# EAGLE design USB Connector (EAGLE 6.5.0)
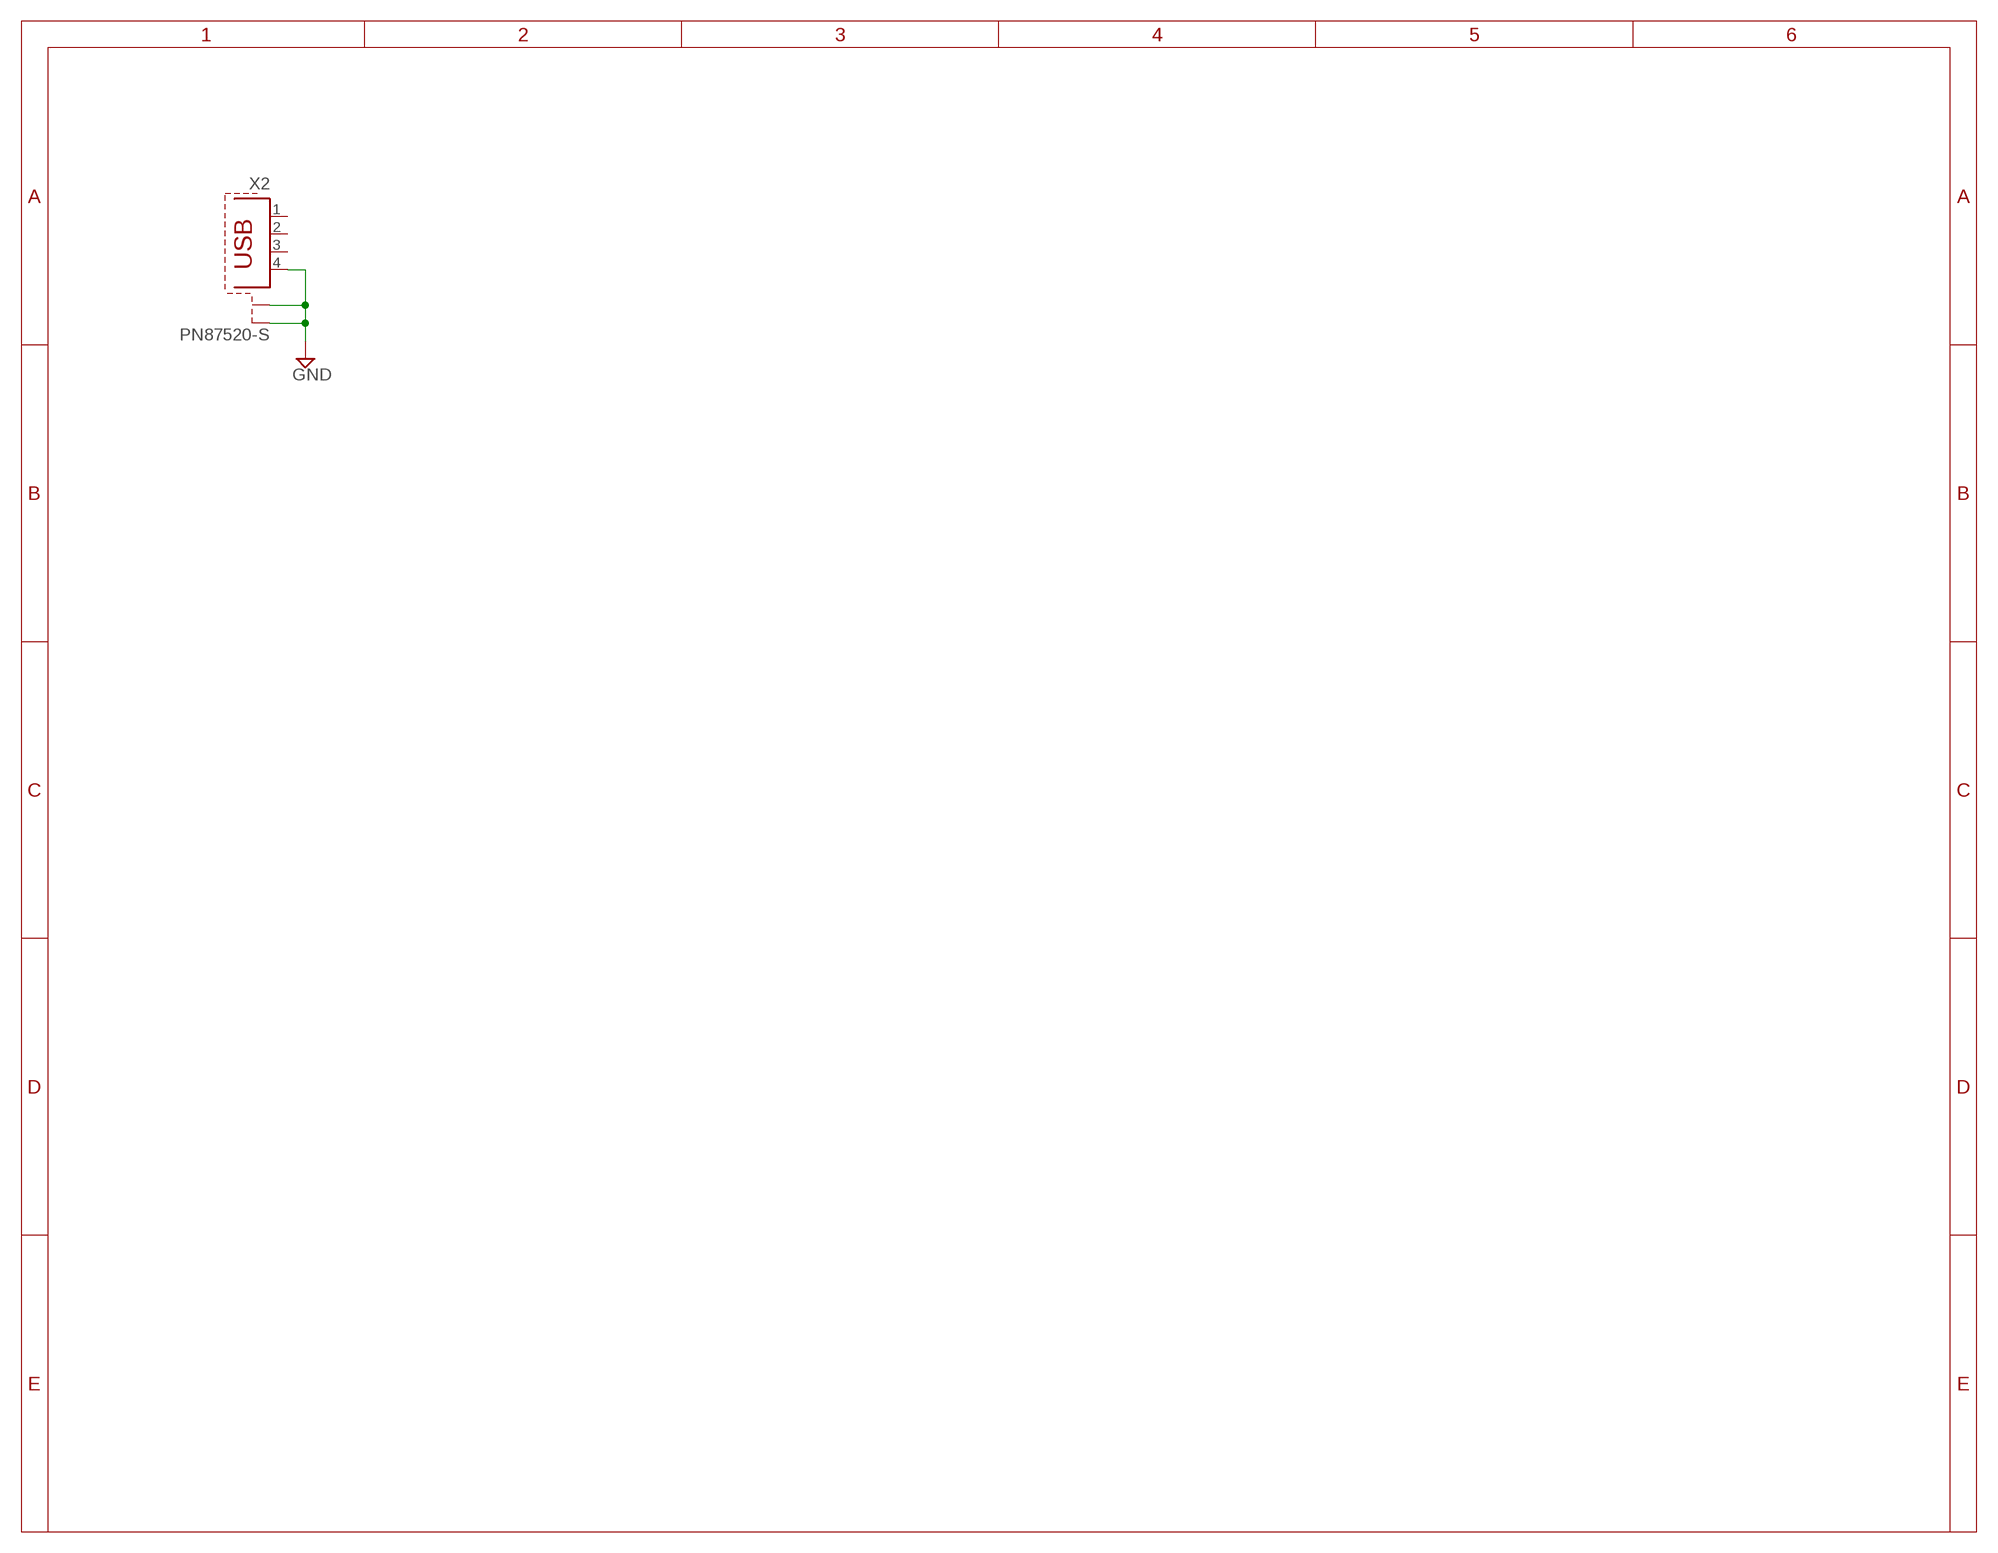
[diagram p0: schematic, sheet 1]

## Parts
X2  PN87520-S  [PN87520-S]

## Nets
GND: X2.4 X2.S1 X2.S2
Unconnected: X2.1 X2.2 X2.3

## Library data of the parts
X2 = con-berg:PN87520-S; OC_FARNELL: unknown; OC_NEWARK: unknown

## Net classes
1 diff: width 0.003 mm, drill 0.006 mm, clearance 0.007 mm

## Board
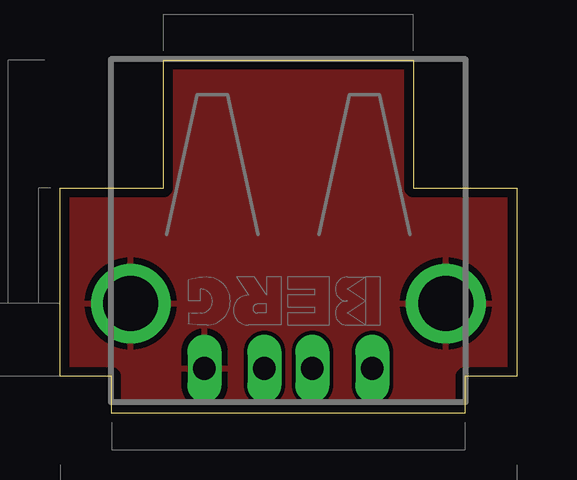
[diagram p1: board, top side]
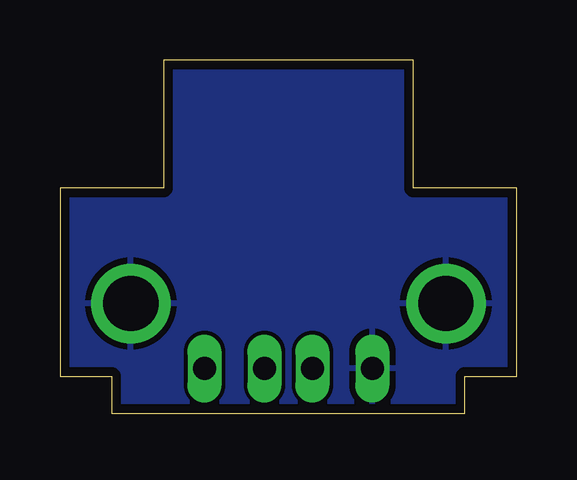
[diagram p2: board, bottom side, seen from below]

Size 19.05 x 14.73 mm. Coordinates in mm from the lower left corner, seen from the top.
Outline: 2.16,0 2.16,1.52 0,1.52 0,9.4 4.32,9.4 4.32,14.73 14.73,14.73 14.73,9.4 19.05,9.4 19.05,1.52 16.89,1.52 16.89,0 2.16,0
Copper layers (1*16): Top 0.0356mm / dielectric 1.5011mm / Bottom 0.0356mm
Design rules "oshpark-2layer-tented-vias": minimum track width 6mil, minimum drill 13mil, track to track 6mil, track to pad 6mil, pad to pad 6mil, via to via 6mil, smd to smd 6mil, copper to edge 15mil, drill to drill 6mil, minimum pad ring 7mil, minimum via ring 7mil, stop-mask expansion 4mil, vias tented up to drill 13mil, thermal gap 10mil
tRestrict: 8 lines

### Footprints (pad centres in the part's own frame; a part is rotated, then mirrored left to right if it is on the bottom)
PN87520-S = drill 0.95 long: 1 -3.5,2.71; 2 -1,2.71; 3 1,2.71; 4 3.5,2.71 | drill 2.3 pad 2.9: S1 -6.57,0; S2 6.57,0

### Placement (x,y rotation side)
X2  9.52,4.57 180 top

### Tracks (layer width: path | path; a pad name or v marks a point on that pad's centre or on a via)
GND
  pour Bottom: -2.41,18.16 19.81,18.16 19.81,0 -2.29,0
  pour Top: 20.32,16.64 -1.9,16.64 -1.9,-1.52 20.19,-1.52